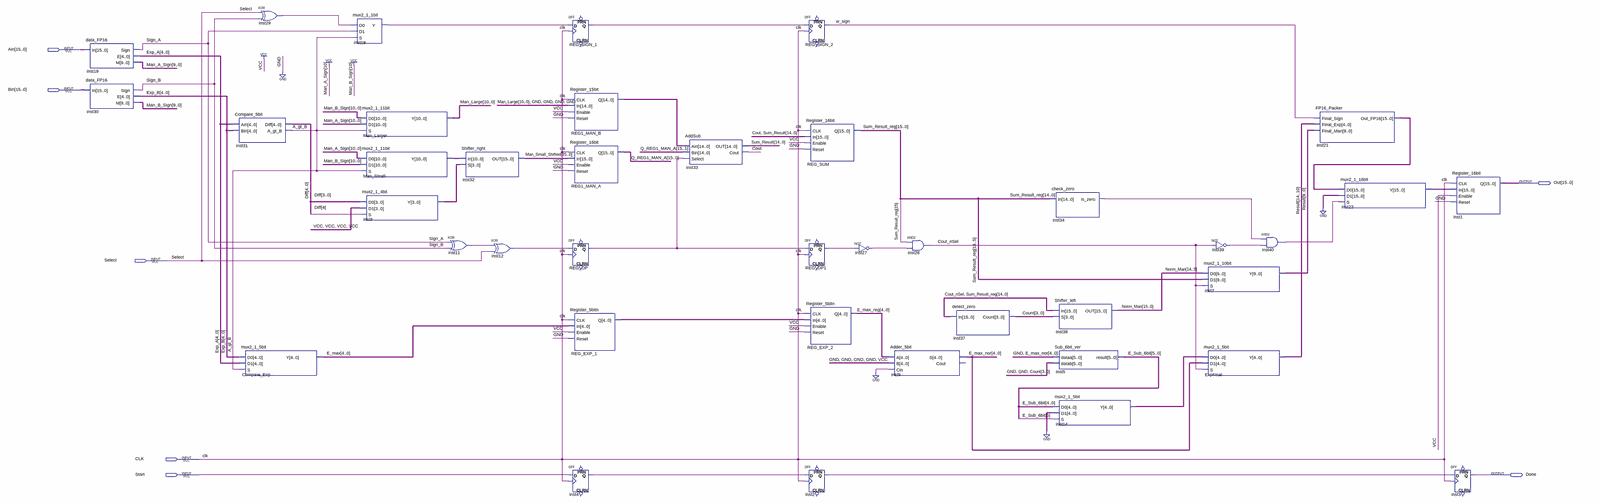
[diagram p0: schematic sheet, whole]
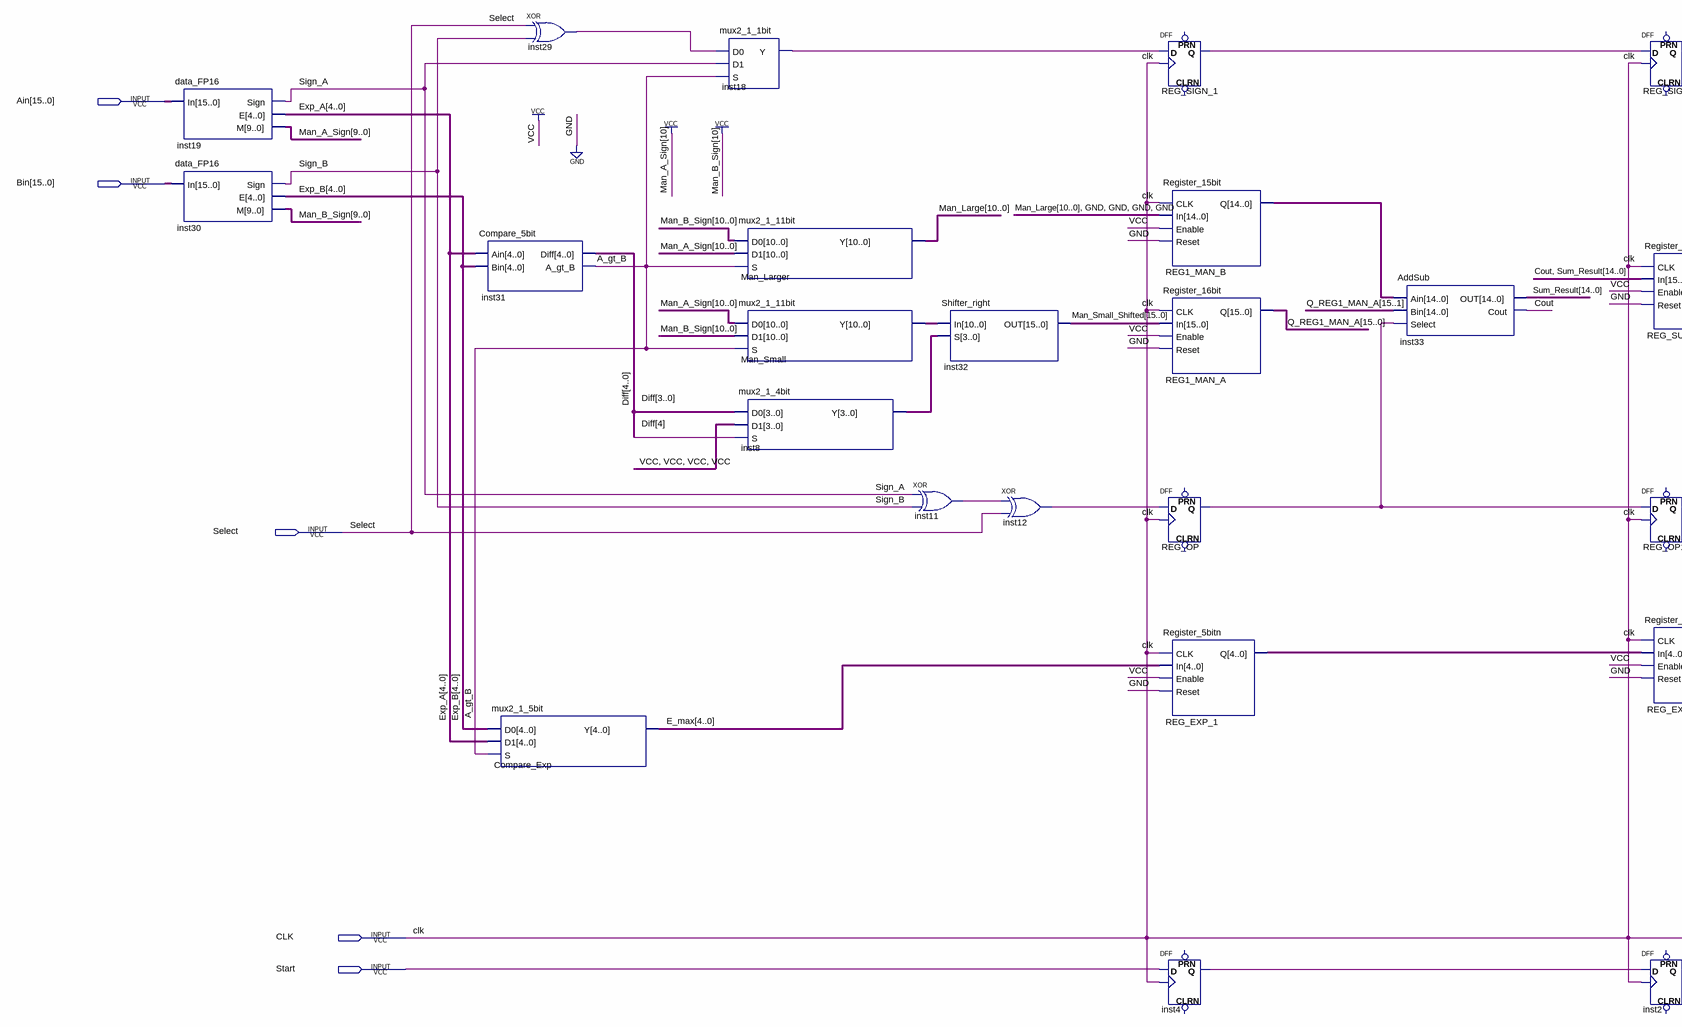
[diagram p1: schematic sheet, left part]
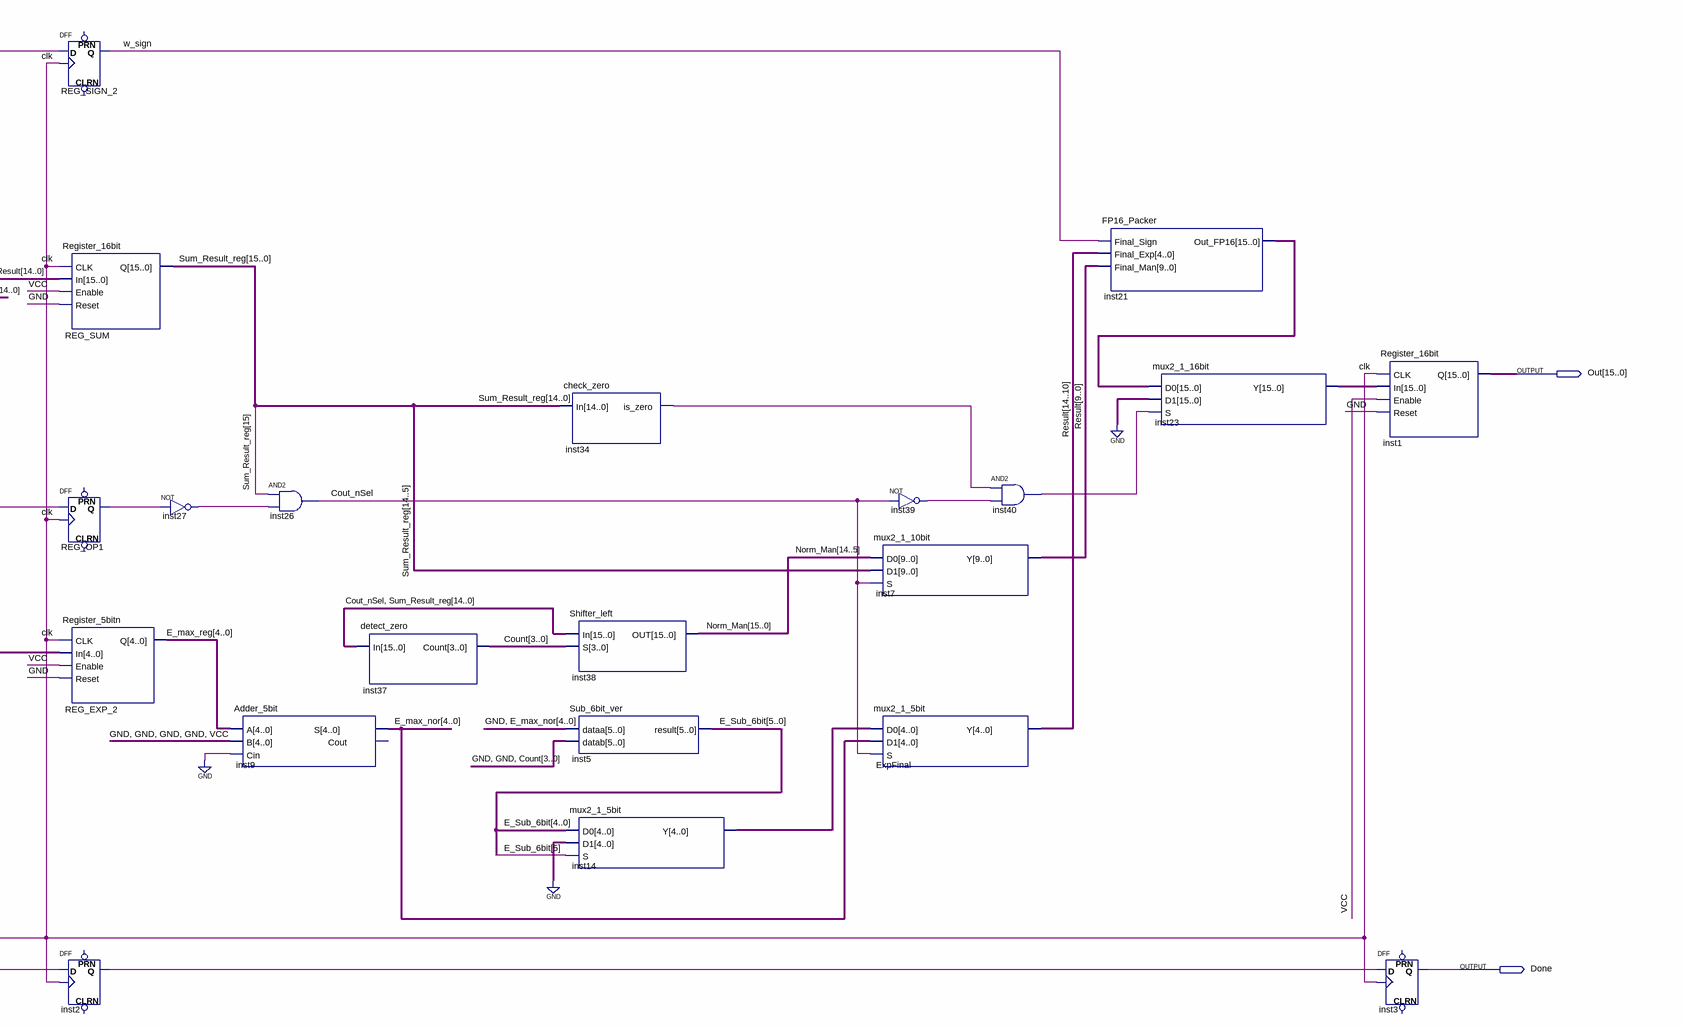
[diagram p2: schematic sheet, right part]
// Quartus schematic Add_SubUnit.bdf as structural Verilog: 40 symbols, 7 pins
module Add_SubUnit (
  input  [15:0] Ain,
  input  [15:0] Bin,
  input  Select,
  input  CLK,
  input  Start,
  output [15:0] Out,
  output Done
);

  wire A_gt_B, Cout, Cout_nSel, inst2_q, inst4_q, inst11_out, inst12_out, inst18_y, inst27_out, inst29_out,
       inst34_is_zero, inst39_out, inst40_out, REG_OP1_q, REG_OP_q, REG_SIGN_1_q, Sign_A, Sign_B, w_sign;
  wire [3:0] Count, inst8_y;
  wire [4:0] Diff, E_max, E_max_nor, E_max_reg, Exp_A, Exp_B, inst14_y, REG_EXP_1_q;
  wire [5:0] E_Sub_6bit;
  wire [9:0] Man_A_Sign, Man_B_Sign;
  wire [10:0] Man_Large, Man_Small_y;
  wire [14:0] REG1_MAN_B_q, Result, Sum_Result;
  wire [15:0] inst21_out_fp16, inst23_y, Man_Small_Shifted, Norm_Man, Q_REG1_MAN_A, Sum_Result_reg;

  data_FP16 inst19 (.In(Ain), .Sign(Sign_A), .E(Exp_A), .M(Man_A_Sign));
  data_FP16 inst30 (.In(Bin), .Sign(Sign_B), .E(Exp_B), .M(Man_B_Sign));
  Compare_5bit inst31 (.Ain(Exp_A), .Bin(Exp_B), .Diff(Diff), .A_gt_B(A_gt_B));
  mux2_1_5bit Compare_Exp (.D0(Exp_B), .D1(Exp_A), .S(A_gt_B), .Y(E_max));
  xor inst29 (inst29_out, Select, Sign_B);
  mux2_1_1bit inst18 (.D0(inst29_out), .D1(Sign_A), .S(A_gt_B), .Y(inst18_y));
  mux2_1_11bit Man_Larger (.D0({1'b1, Man_B_Sign}), .D1({1'b1, Man_A_Sign}), .S(A_gt_B), .Y(Man_Large));
  mux2_1_11bit Man_Small (.D0({1'b1, Man_A_Sign}), .D1({1'b1, Man_B_Sign}), .S(A_gt_B), .Y(Man_Small_y));
  mux2_1_4bit inst8 (.D0(Diff[3:0]), .D1(4'b1111), .S(Diff[4]), .Y(inst8_y));
  xor inst11 (inst11_out, Sign_A, Sign_B);
  Shifter_right inst32 (.In(Man_Small_y), .S(inst8_y), .OUT(Man_Small_Shifted));
  xor inst12 (inst12_out, inst11_out, Select);
  DFF REG_SIGN_1 (.CLK(CLK), .D(inst18_y), .Q(REG_SIGN_1_q));  // open: CLRN, PRN
  Register_15bit REG1_MAN_B (.CLK(CLK), .In({Man_Large, 4'b0000}), .Enable(1'b1), .Reset(1'b0), .Q(REG1_MAN_B_q));
  Register_16bit REG1_MAN_A (.CLK(CLK), .In(Man_Small_Shifted), .Enable(1'b1), .Reset(1'b0), .Q(Q_REG1_MAN_A));
  DFF REG_OP (.CLK(CLK), .D(inst12_out), .Q(REG_OP_q));  // open: CLRN, PRN
  Register_5bitn REG_EXP_1 (.CLK(CLK), .In(E_max), .Enable(1'b1), .Reset(1'b0), .Q(REG_EXP_1_q));
  DFF inst4 (.CLK(CLK), .D(Start), .Q(inst4_q));  // open: CLRN, PRN
  AddSub inst33 (.Ain(REG1_MAN_B_q), .Bin(Q_REG1_MAN_A[15:1]), .Select(REG_OP_q), .OUT(Sum_Result), .Cout(Cout));
  DFF REG_SIGN_2 (.CLK(CLK), .D(REG_SIGN_1_q), .Q(w_sign));  // open: CLRN, PRN
  Register_16bit REG_SUM (.CLK(CLK), .In({Cout, Sum_Result}), .Enable(1'b1), .Reset(1'b0), .Q(Sum_Result_reg));
  DFF REG_OP1 (.CLK(CLK), .D(REG_OP_q), .Q(REG_OP1_q));  // open: CLRN, PRN
  Register_5bitn REG_EXP_2 (.CLK(CLK), .In(REG_EXP_1_q), .Enable(1'b1), .Reset(1'b0), .Q(E_max_reg));
  DFF inst2 (.CLK(CLK), .D(inst4_q), .Q(inst2_q));  // open: CLRN, PRN
  not inst27 (inst27_out, REG_OP1_q);
  Adder_5bit inst9 (.A(E_max_reg), .B(5'b00001), .Cin(1'b0), .S(E_max_nor));  // open: Cout
  and inst26 (Cout_nSel, Sum_Result_reg[15], inst27_out);
  detect_zero inst37 (.In({Cout_nSel, Sum_Result_reg[14:0]}), .Count(Count));
  check_zero inst34 (.In(Sum_Result_reg[14:0]), .is_zero(inst34_is_zero));
  Shifter_left inst38 (.In({Cout_nSel, Sum_Result_reg[14:0]}), .S(Count), .OUT(Norm_Man));
  Sub_6bit_ver inst5 (.dataa({1'b0, E_max_nor}), .datab({2'b00, Count}), .result(E_Sub_6bit));
  mux2_1_5bit inst14 (.D0(E_Sub_6bit[4:0]), .D1({5{1'b0}}), .S(E_Sub_6bit[5]), .Y(inst14_y));
  not inst39 (inst39_out, Cout_nSel);
  mux2_1_10bit inst7 (.D0(Norm_Man[14:5]), .D1(Sum_Result_reg[14:5]), .S(Cout_nSel), .Y(Result[9:0]));
  mux2_1_5bit ExpFinal (.D0(inst14_y), .D1(E_max_nor), .S(Cout_nSel), .Y(Result[14:10]));
  and inst40 (inst40_out, inst34_is_zero, inst39_out);
  FP16_Packer inst21 (
    .Final_Sign(w_sign), .Final_Exp(Result[14:10]), .Final_Man(Result[9:0]), .Out_FP16(inst21_out_fp16));
  mux2_1_16bit inst23 (.D0(inst21_out_fp16), .D1({16{1'b0}}), .S(inst40_out), .Y(inst23_y));
  Register_16bit inst1 (.CLK(CLK), .In(inst23_y), .Enable(1'b1), .Reset(1'b0), .Q(Out));
  DFF inst3 (.CLK(CLK), .D(inst2_q), .Q(Done));  // open: CLRN, PRN
endmodule
